# Altium schematic sheet Brake.SchDoc
size A4; SheetNumber: 6; SheetTotal: 8
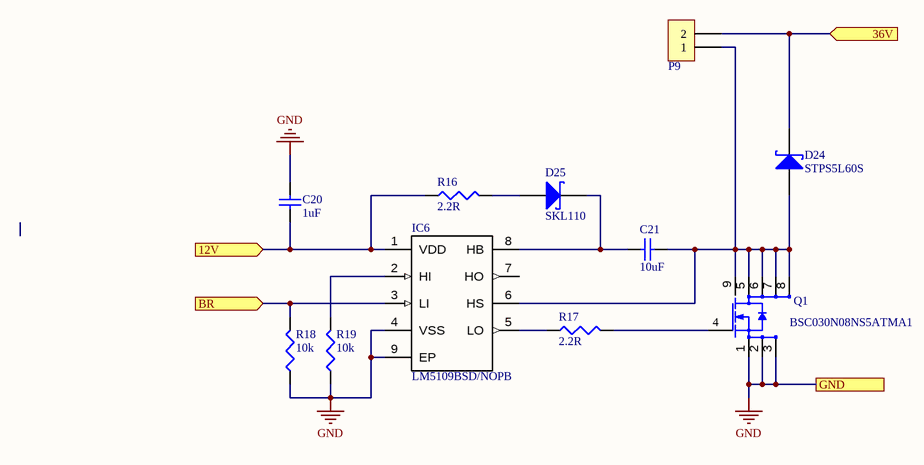
[diagram p0: Brake.SchDoc]

## Parts
C20  1uF  [C1608-0603]
C21  10uF  [C1608-0603]
D24  STPS5L60S  [SMCJ]
D25  SKL110  [SODFL370X140-2N]
IC6  LM5109BSD/NOPB  [PSON80P400X80_HS-9N]
P9  15EDGRC-3.81-02  [15EDGRC-3.81-02]  (value not drawn)
Q1  BSC030N08NS5ATMA1  [PG-TDSON-8]
R16  2.2R  [R1608-0603]
R17  2.2R  [R1608-0603]
R18  10k  [R1608-0603]
R19  10k  [R1608-0603]

## Ports
12V (in), 36V (in), BR (in), GND

## Nets
GND: C20.2 IC6.4(VSS) IC6.9(EP) Q1.1(S) Q1.2(S) Q1.3(S) R18.1 R19.1 ; port GND
12V: C20.1 IC6.1(VDD) R16.1 ; port 12V
36V: D24.1(K) P9.2 ; port 36V
BR: IC6.3(LI) R18.2 ; port BR
NetC21_1: C21.1 D25.1(K) IC6.8(HB)
NetC21_2: C21.2 D24.2(A) IC6.6(HS) P9.1 Q1.5(D) Q1.6(D) Q1.7(D) Q1.8(D) Q1.9(D)
NetD25_2: D25.2(A) R16.2
NetIC6_2: IC6.2(HI) R19.2
NetIC6_5: IC6.5(LO) R17.1
NetQ1_4: Q1.4(G) R17.2

Not connected (* = marked no-connect by the designer): IC6 7(HO)

## Library data of the parts
C20 C21 = Cap: Керамическийконденсатор; Корпус: 0603 (1608 Metric); Диэлектрик: X5R; Напряжение: 16B; Вид монтажа: SMD; Температурный диапазон: -55 ~ 100; Тип элемента: Керамический конденсатор
  C20: Номинал: 1uF
  C21: Номинал: 10uF
D24 = STPS5L60S: Диод Шоттки 60В 5А [SMC]; Производитель: STMicroelectronics; Корпус: do-214ab/smc; Вид монтажа: SMD; Название: STPS5L60S; Артикул: STPS5L60S; Напряжение: 60В; Тип элемента: Диод шоттки
D25 = SKL110: Диод Шоттки 100В 1А; Производитель: STMicroelectronics; Корпус: do-214ab/smc; Вид монтажа: SMD; Название: SKL110; Артикул: SKL110; Напряжение: 100В; Тип элемента: Диод шоттки
IC6 = LM5109BSD/NOPB: Драйвер MOSFET; Номинал: 108V/1A; Вид монтажа: SMD; Тип элемента: Микросхема; Температурный диапазон: -40 to +125 °C; Название: LM5109BSD/NOPB; Артикул: LM5109BSD/NOPB
P9 = 15EDGRC-3.81-02: Разъем штыревой на плату (папа); Производитель: Degson; Номинал: 8А; Напряжение: 300В; Вид монтажа: DIP; Температурный диапазон: -40℃~105℃; Примечание: шаг 3.81 мм; Название: 15EDGRC-3.81-02; Артикул: 15EDGRC-3.81-02; Тип элемента: Разъем
Q1 = BSC030N08NS5ATMA1: N - канальный MOSFET; Номинал: 80V/100A; Вид монтажа: SMD; Тип элемента: Полевой транзистор; Температурный диапазон: -40 to +125 °C; Название: BSC030N08NS5ATMA1; Артикул: BSC030N08NS5ATMA1
R16-R19 = resistor: SMD резистор; Производитель: 1%; Корпус: 0603 (1608 Metric); Точность: 1%; Название: Резистор; Вид монтажа: SMD; Тип элемента: Резистор
  R16 R17: Номинал: 2.2R
  R18 R19: Номинал: 10k